# Altium project R1250GSA Foglamp Swith (v2.0).PrjPcb
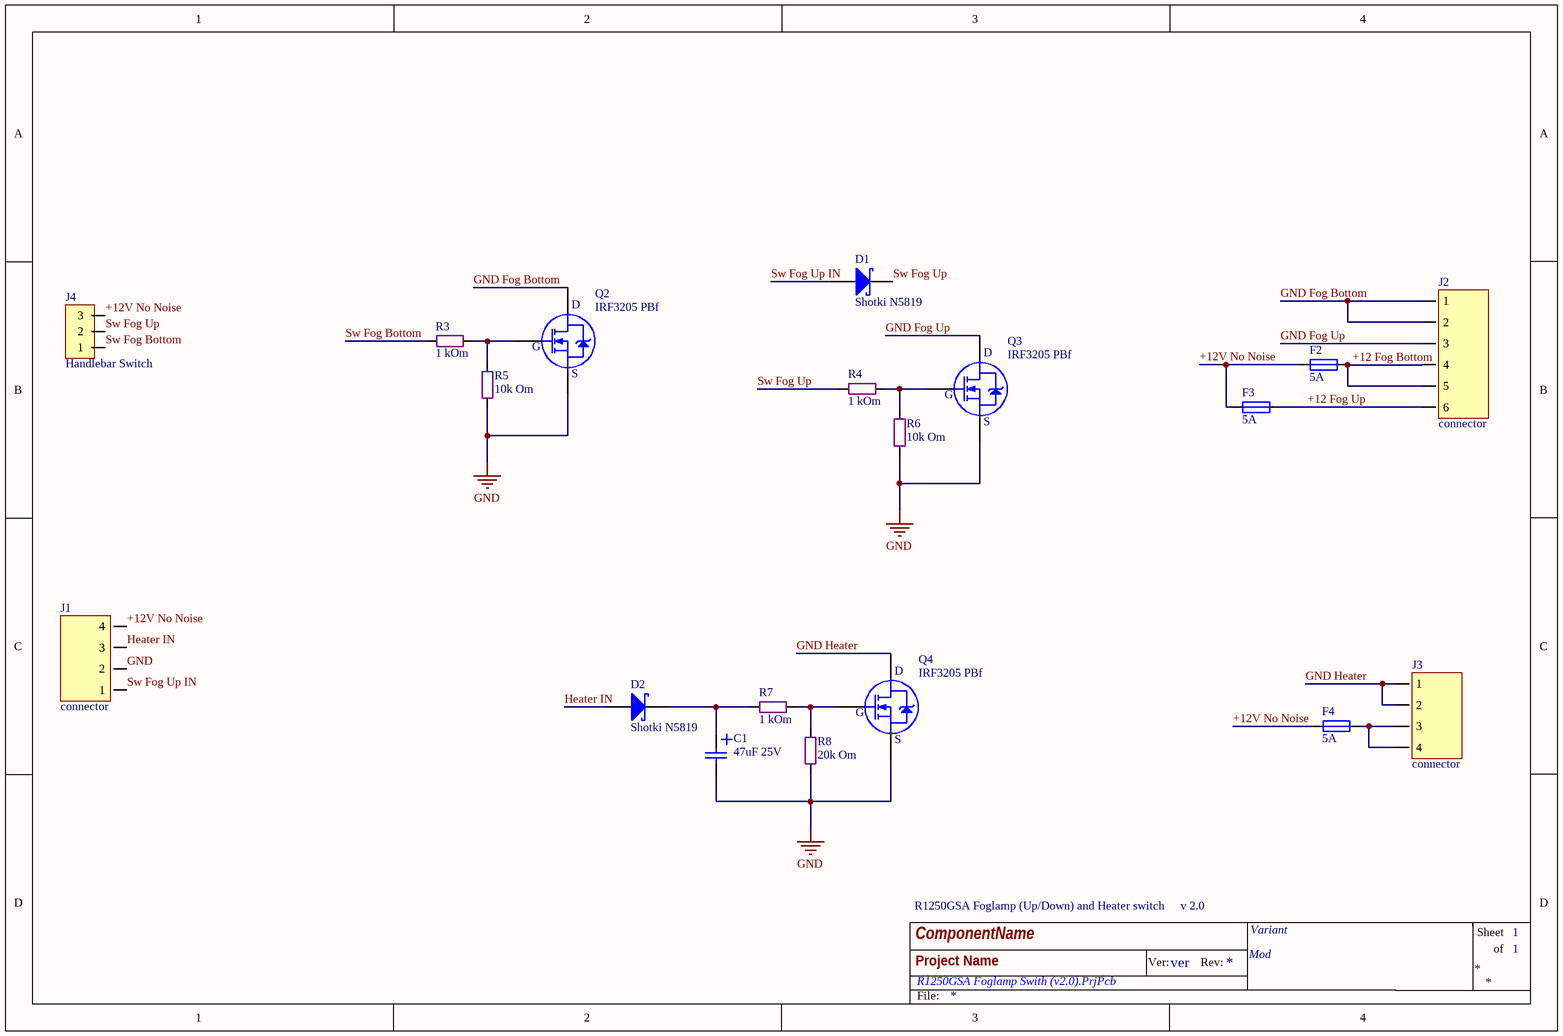
[diagram p0: R1250GSA Foglamp Swith (v2.0).SchDoc]
1 sheet, 19 parts. Net scope: global (net labels, ports and power ports of the same name join across sheets).
Board file: R1250GSA Foglamp Swith (v2.0).PcbDoc

## Sheet R1250GSA Foglamp Swith (v2.0).SchDoc: ComponentName
size A4; SheetNumber: 1; SheetTotal: 1; Version: ver; Variant: Variant; Modification: Mod; Project: Project Name

### Parts
C1  47uF 25V  [Cap E p2mm D6.5xH11]
D1  Shotki N5819  [Diode DO-41]
D2  Shotki N5819  [Diode DO-41]
F2  5A  [Fuse RGE1100]
F3  5A  [Fuse RGE1100]
F4  5A  [Fuse RGE1100]
J1  connector  [Molex Mini-Fit Jr - 4Pin V]
J2  connector  [Molex Mini-Fit Jr - 6Pin V]
J3  connector  [Molex Mini-Fit Jr - 4Pin V]
J4  Handlebar Switch  [WF-3]
Q2  IRF3205 PBf  [TO220-2]
Q3  IRF3205 PBf  [TO220-2]
Q4  IRF3205 PBf  [TO220-2]
R3  1 kOm  [SMD 0805 (2012)]
R4  1 kOm  [SMD 0805 (2012)]
R5  10k Om  [SMD 0805 (2012)]
R6  10k Om  [SMD 0805 (2012)]
R7  1 kOm  [SMD 0805 (2012)]
R8  20k Om  [SMD 0805 (2012)]

### Nets
GND: C1.2 J1.2 Q2.3(S) Q3.3(S) Q4.3(S) R5.1 R6.1 R8.1
+12 Fog Bottom: F2.2 J2.4 J2.5
+12 Fog Up: F3.2 J2.6
+12V No Noise: F2.1 F3.1 F4.1 J1.4 J4.3
GND Fog Bottom: J2.1 J2.2 Q2.2(D)
GND Fog Up: J2.3 Q3.2(D)
GND Heater: J3.1 J3.2 Q4.2(D)
Heater IN: D2.A J1.3
Sw Fog Bottom: J4.1 R3.1
Sw Fog Up: D1.K J4.2 R4.1
Sw Fog Up IN: D1.A J1.1
NetC1_1: C1.1 D2.K R7.1
NetF4_2: F4.2 J3.3 J3.4
NetQ2_1: Q2.1(G) R3.2 R5.2
NetQ3_1: Q3.1(G) R4.2 R6.2
NetQ4_1: Q4.1(G) R7.2 R8.2

### Notes on the sheet
- R1250GSA Foglamp (Up/Down) and Heater switch
- v 2.0
- Ver:
- Rev:
- Sheet
- of
- File:

### Library data of the parts
C1 = Cap Elecrolitic: Capacitor
D1 D2 = D Shotki All: Shotki  Diode; VALUE: 1N5822; PackageReference: DO-201
F2-F4 = Fuse: Round fuse
J1 J3 = Molex Mini-Fit Jr - 4 pin: Right, Dbl line, Female
J2 = Molex Mini-Fit Jr - 6 pin: Right, Dbl line, Female
J4 = WF-3: Standart Fan MB's Connector
Q2-Q4 = IRF3205: N-Channel 55V - 0.008Ω - 110A; Monufacturer: IOR; RDS Сопротивление Сток-Исток: 0.008 Om; I d - Drain current (continuous) at TC = 100°C: 80 A; VGS Порог Открытия: +2....+4 V; VGS Макс напр на гейте: +-20 V; C ISS Входная емкость: 3247 pF; C OSS Выходная емкость: 781 pF; V DSS (v): 55V; I d - Drain current (continuous) at TC = 25°C: 110 A; Name: IRF3205 PBf; Datasheet: http://tec.org.ru/_bd/2/223_IRF3205.pdf; URL: http://tec.org.ru/board/49-1-0-223
R3-R8 = Res All Types